# EAGLE design MJ818 clone - rev.5 - SN Mini2 - TCAN334 - prod (EAGLE 9.6.2)
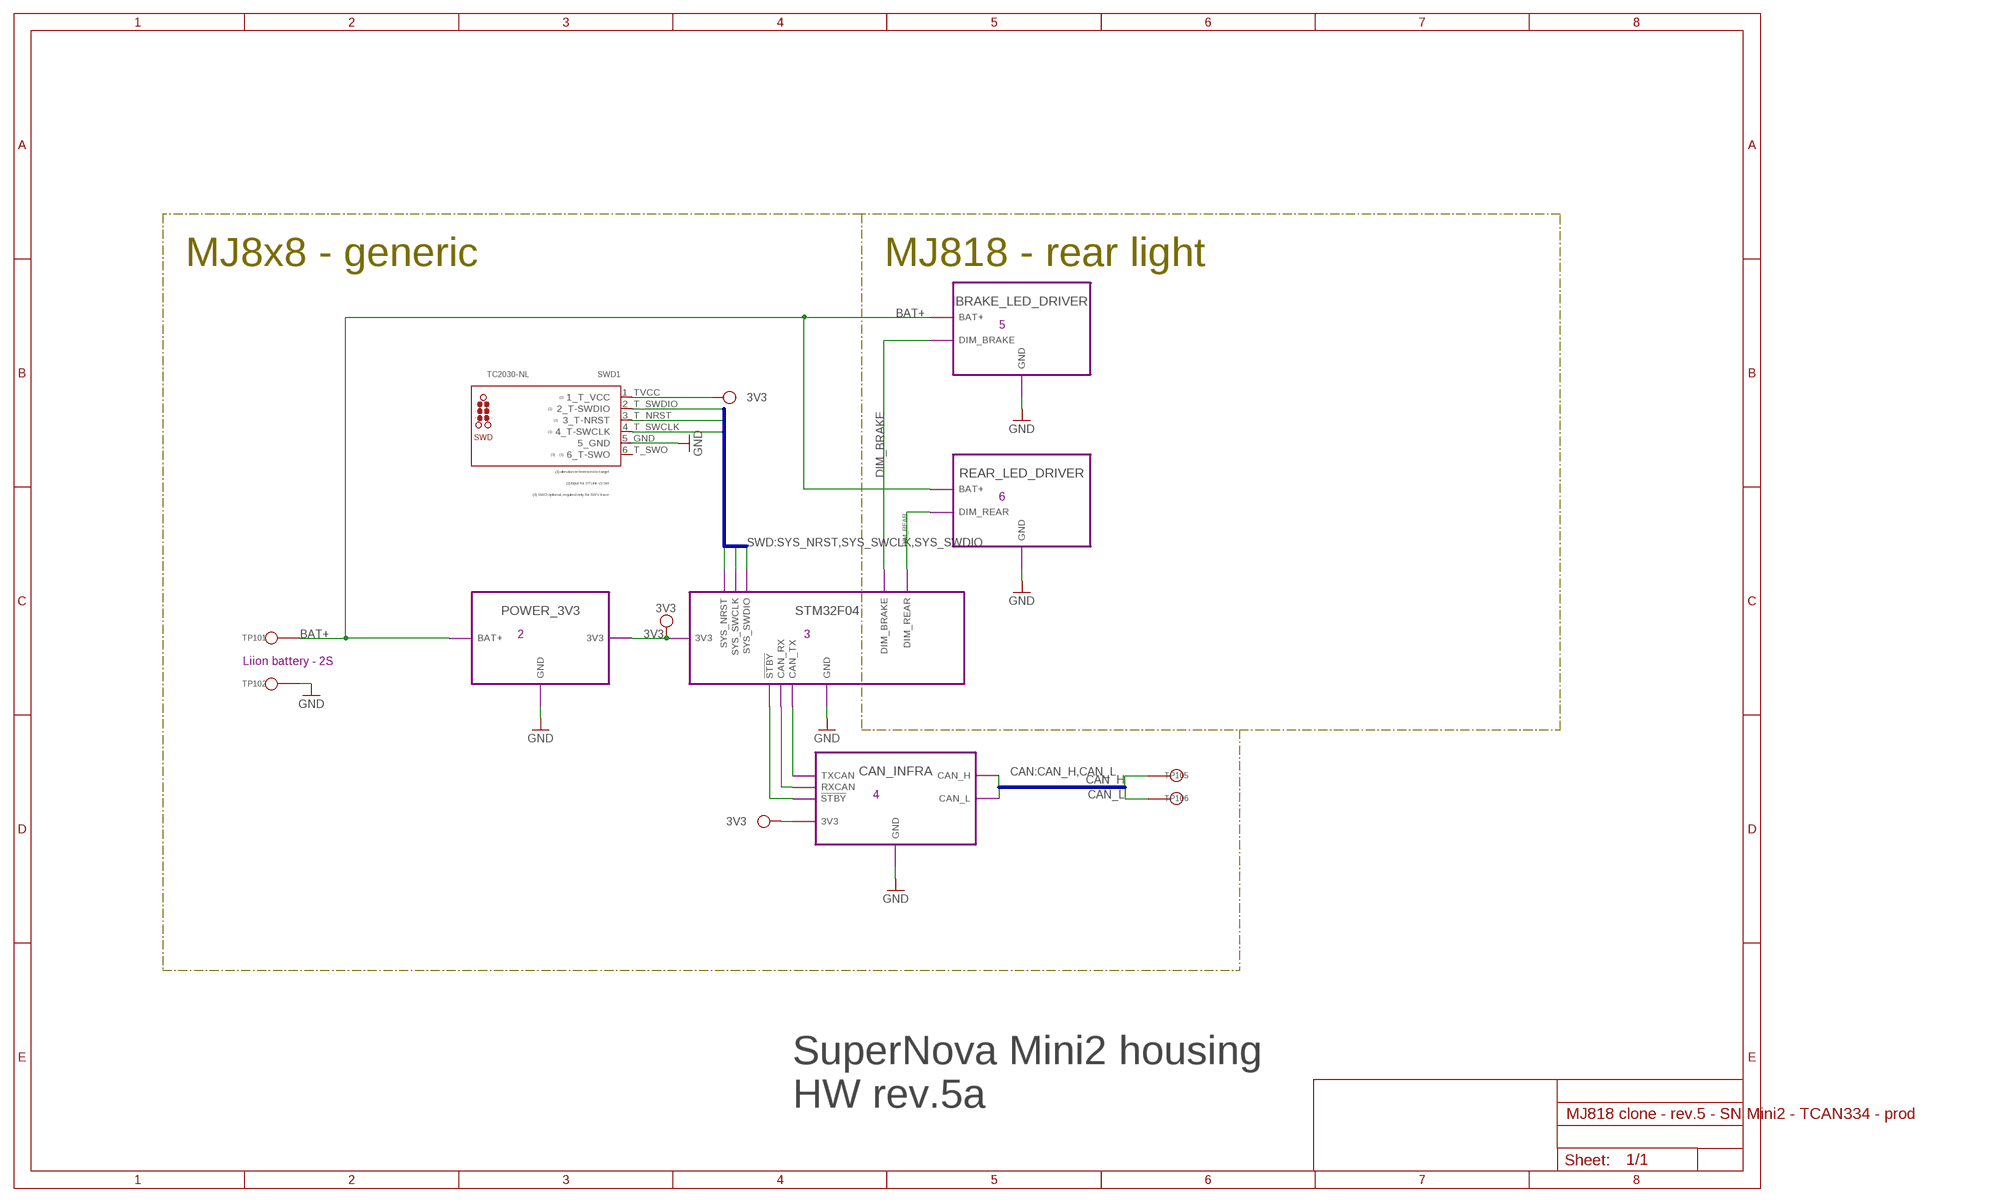
[diagram p0: schematic, sheet 1]

## Parts
SWD1  TC2030-NL  TC2030  [TC2030-NL]
TP101  LiIon + Terminal  TP  [TH-0.6]
TP102  LiIon - Terminal  TP  [TH-0.6]
TP105  CAN high  TP  [TH-0.6]
TP106  CAN low  TP  [TH-0.6]

## Module instances
POWER_3V3 = POWER_3V3 (part numbers offset by 200)
STM32F04 = STM32 (part numbers offset by 300)
CAN_INFRA = CAN_INFRA (part numbers offset by 400)
BRAKE_LED_DRIVER = LED_DRIVER_BRAKE-LIGHT (part numbers offset by 500)
REAR_LED_DRIVER = LED_DRIVER_REAR-LIGHT (part numbers offset by 600)

## Nets
3V3 [3V3]: SWD1.1_TVCC(1_T_VCC) ; port STM32F04.3V3 POWER_3V3.3V3 CAN_INFRA.3V3
!STBY! [signal]: port CAN_INFRA.!STBY! STM32F04.!STBY!
BAT+ [BAT+]: TP101.TP$1 ; port POWER_3V3.BAT+ BRAKE_LED_DRIVER.BAT+ REAR_LED_DRIVER.BAT+
CAN_H [signal]: TP105.TP$1 ; port CAN_INFRA.CAN_H
CAN_L [signal]: TP106.TP$1 ; port CAN_INFRA.CAN_L
CAN_RX [signal]: port CAN_INFRA.RXCAN STM32F04.CAN_RX
CAN_TX [signal]: port CAN_INFRA.TXCAN STM32F04.CAN_TX
DIM_BRAKE [signal]: port STM32F04.DIM_BRAKE BRAKE_LED_DRIVER.DIM_BRAKE
DIM_REAR [signal]: port STM32F04.DIM_REAR REAR_LED_DRIVER.DIM_REAR
GND: SWD1.5_GND TP102.TP$1 ; port STM32F04.GND POWER_3V3.GND CAN_INFRA.GND BRAKE_LED_DRIVER.GND REAR_LED_DRIVER.GND
SYS_NRST [signal]: SWD1.3_T_NRST(3_T-NRST) ; port STM32F04.SYS_NRST
SYS_SWCLK [signal]: SWD1.4_T_SWCLK(4_T-SWCLK) ; port STM32F04.SYS_SWCLK
SYS_SWDIO [signal]: SWD1.2_T_SWDIO(2_T-SWDIO) ; port STM32F04.SYS_SWDIO
Unconnected: SWD1.6_T_SWO(6_T-SWO)

## Buses
CAN:CAN_H,CAN_L
SWD:SYS_NRST,SYS_SWCLK,SYS_SWDIO

## Notes on the sheet
- MJ8x8 - generic | MJ818 - rear light
- 5
- 6
- 2 | 3
- Liion battery - 2S
- 4
- SuperNova Mini2 housing
  HW rev.5a

## Library data of the parts
SWD1 = tag-connect:TC2030: TC2030 pad no. Function STLink v3 CN1 pin no. Function 1 Reserved (1) 2 Reserved (1) 1 T_Vcc 3 T_Vcc (2) 2 T_SWDIO 4 T_JTMS/T_SWDIO 5 GND 4 T_SWCLK 6 T_JCLK / T_SWCLK 5 GND 7 GND 6 8 T_JTDO / T_SWO (3) 9 T_JRCLK (4) / NC (5) 10 T_JTDI / NC (5) 11 GNDDetect (6) 3 T_NRST 12 T_NRST 13 T_VCP_RX (7) 14 T_VCP_TX (2) (1) Do not connect to the target (2) Input for STLINK-V3SET (3) SWO is optional, required only for Serial Wire Viewer (SWV) trace (4) Optional loopback of T_JCLK on the target side, required if loopback is removed on the STLINK-V3SET side (5) NC means not required for the SWD connection (6) Tied to GND by STLINK-V3SET firmware; may be used by the target for detection of the tool (7) Output for STLINK-V3SET
TP101 TP102 TP105 TP106 = signal testpoint:TP

## Module POWER_3V3
Ports: GND(pwr) BAT+(pwr) 3V3(pwr)
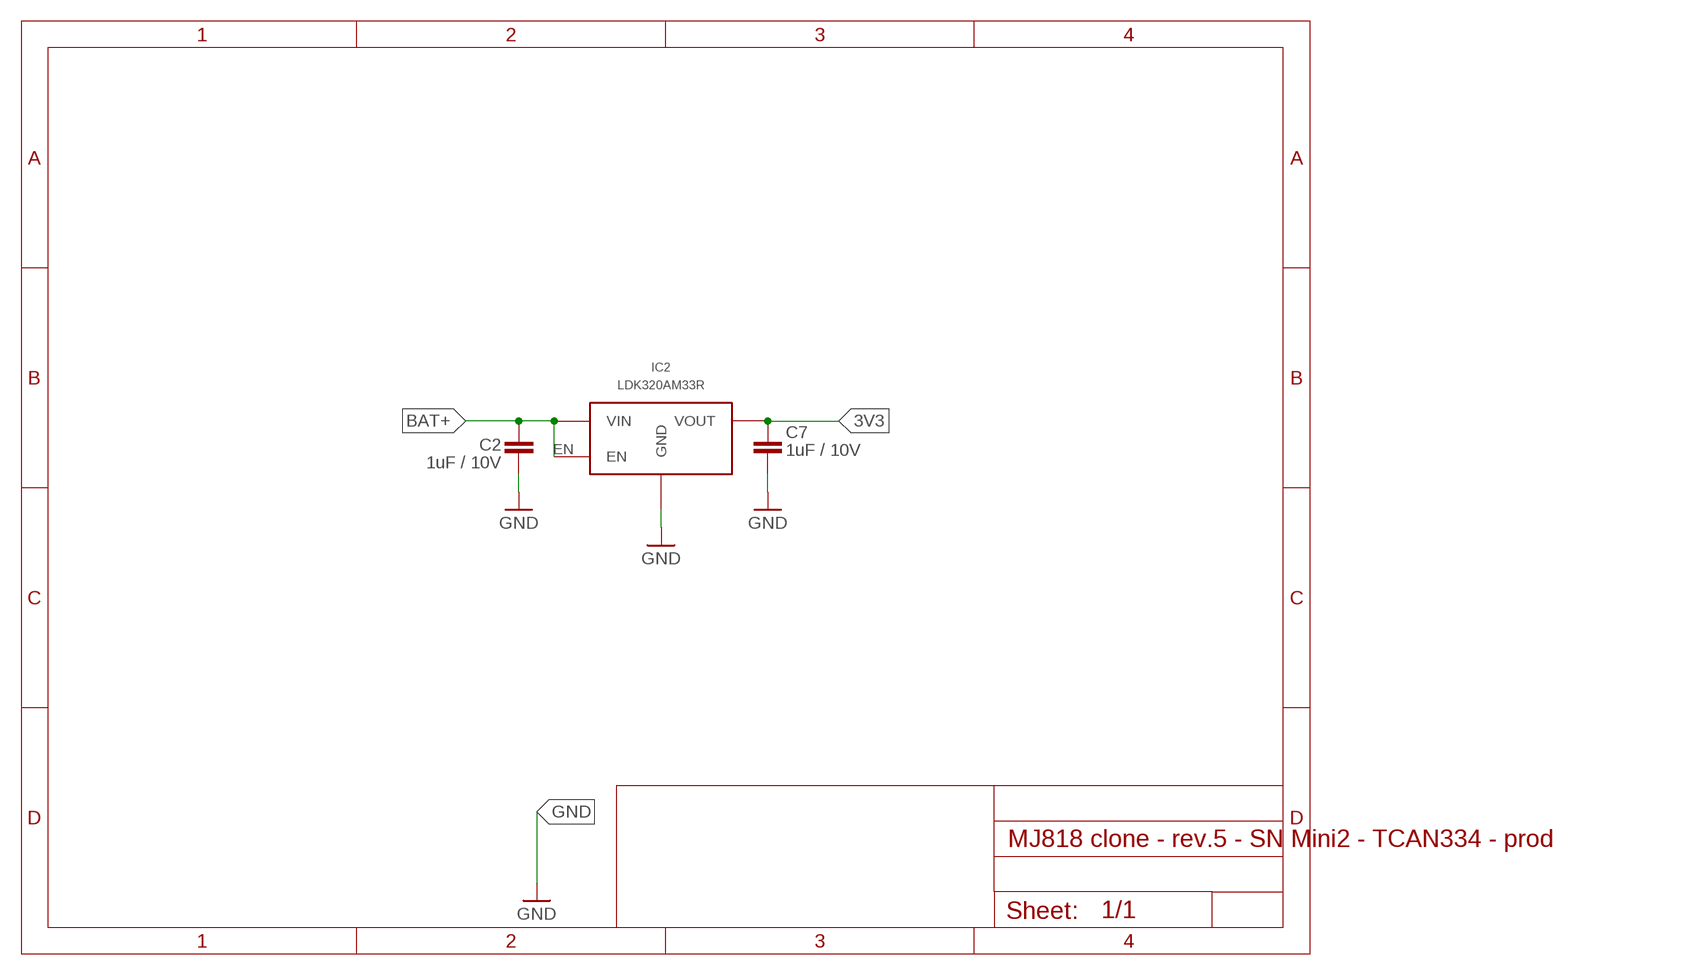
[diagram p1: schematic, module POWER_3V3, sheet 1]

### Parts
C2  1uF / 10V  C-EUC0402  [C0402]
C7  1uF / 10V  C-EUC0402  [C0402]
IC2  LDK320AM33R  LDK320SOT-23-5L  [SOT-23-5L]

### Nets
3V3: C7.2 IC2.OUT(VOUT)
BAT+ [BAT+]: C2.1 IC2.EN IC2.IN(VIN)
GND: C2.2 C7.1 IC2.GND

### Library data of the parts
C2 C7 = rcl:C-EU: CAPACITOR, European symbol; SPICEPREFIX: C
IC2 = LDK320 5V LDO:LDK320

## Module STM32
Ports: GND(pwr) 3V3(pwr) SYS_NRST(in) SYS_SWCLK(io) SYS_SWDIO(io) CAN_RX(in) CAN_TX(out) !STBY!(out) DIM_REAR(out) DIM_BRAKE(out)
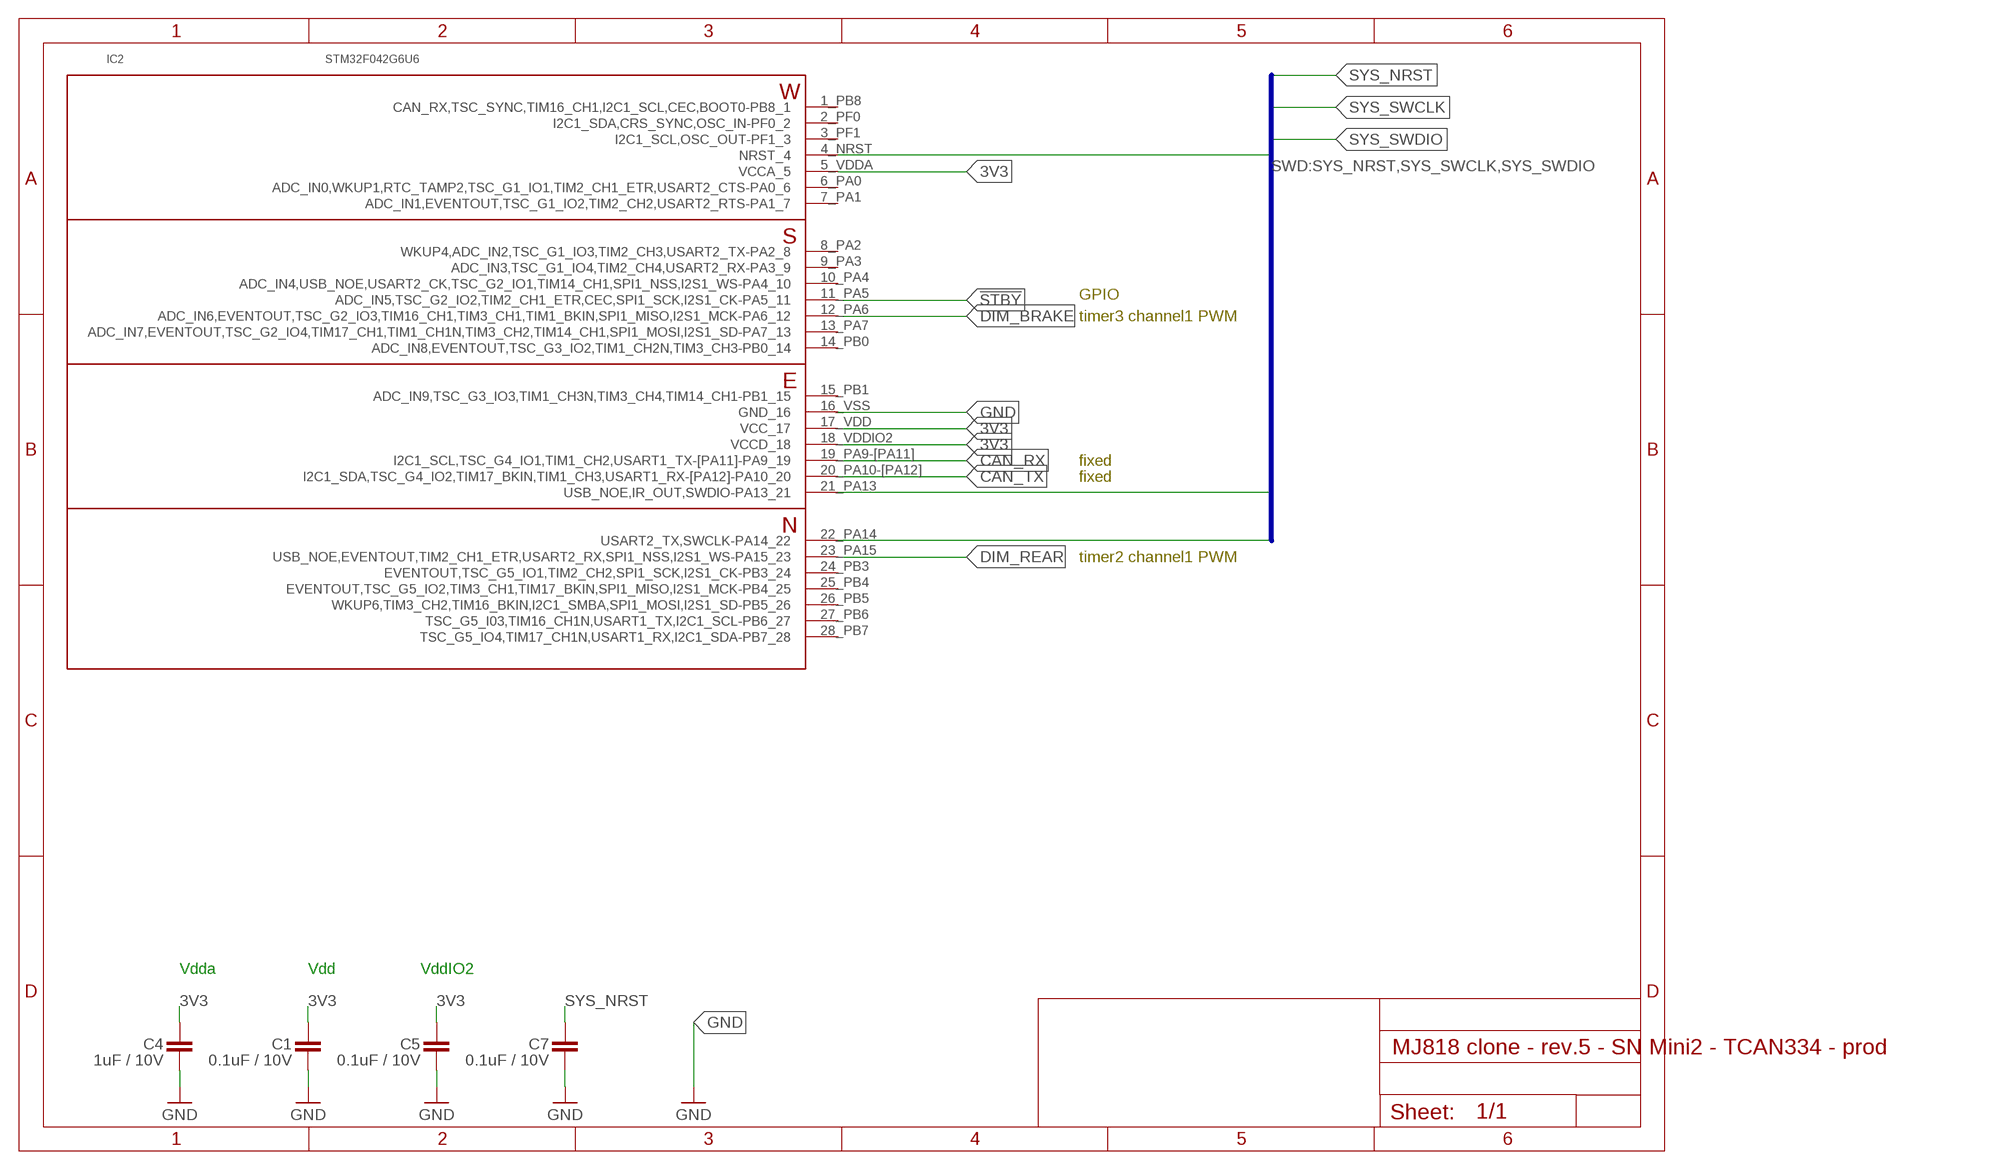
[diagram p2: schematic, module STM32, sheet 1]

### Parts
C1  0.1uF / 10V  C-EUC0402  [C0402]
C4  1uF / 10V  C-EUC0402  [C0402]
C5  0.1uF / 10V  C-EUC0402  [C0402]
C7  0.1uF / 10V  C-EUC0402  [C0402]
IC2  STM32F042G6U6  STM32F042G6  [UFQFPN-28]

### Nets
3V3 [3V3]: C1.2 C4.2 C5.2 IC2.5_VDDA(VCCA_5) IC2.17_VDD(VCC_17) IC2.18_VDDIO2(VCCD_18)
!STBY!: IC2.11_PA5(ADC_IN5,TSC_G2_IO2,TIM2_CH1_ETR,CEC,SPI1_SCK,I2S1_CK-PA5_11)
CAN_RX: IC2.19_PA9-[PA11](I2C1_SCL,TSC_G4_IO1,TIM1_CH2,USART1_TX-[PA11]-PA9_19)
CAN_TX: IC2.20_PA10-[PA12](I2C1_SDA,TSC_G4_IO2,TIM17_BKIN,TIM1_CH3,USART1_RX-[PA12]-PA10_20)
DIM_BRAKE: IC2.12_PA6(ADC_IN6,EVENTOUT,TSC_G2_IO3,TIM16_CH1,TIM3_CH1,TIM1_BKIN,SPI1_MISO,I2S1_MCK-PA6_12)
DIM_REAR: IC2.23_PA15(USB_NOE,EVENTOUT,TIM2_CH1_ETR,USART2_RX,SPI1_NSS,I2S1_WS-PA15_23)
GND: C1.1 C4.1 C5.1 C7.1 IC2.16_VSS(GND_16)
SYS_NRST: C7.2 IC2.4_NRST(NRST_4)
SYS_SWCLK: IC2.22_PA14(USART2_TX,SWCLK-PA14_22)
SYS_SWDIO: IC2.21_PA13(USB_NOE,IR_OUT,SWDIO-PA13_21)
Unconnected: IC2.1_PB8(CAN_RX,TSC_SYNC,TIM16_CH1,I2C1_SCL,CEC,BOOT0-PB8_1) IC2.2_PF0(I2C1_SDA,CRS_SYNC,OSC_IN-PF0_2) IC2.3_PF1(I2C1_SCL,OSC_OUT-PF1_3) IC2.6_PA0(ADC_IN0,WKUP1,RTC_TAMP2,TSC_G1_IO1,TIM2_CH1_ETR,USART2_CTS-PA0_6) IC2.7_PA1(ADC_IN1,EVENTOUT,TSC_G1_IO2,TIM2_CH2,USART2_RTS-PA1_7) IC2.8_PA2(WKUP4,ADC_IN2,TSC_G1_IO3,TIM2_CH3,USART2_TX-PA2_8) IC2.9_PA3(ADC_IN3,TSC_G1_IO4,TIM2_CH4,USART2_RX-PA3_9) IC2.10_PA4(ADC_IN4,USB_NOE,USART2_CK,TSC_G2_IO1,TIM14_CH1,SPI1_NSS,I2S1_WS-PA4_10) IC2.13_PA7(ADC_IN7,EVENTOUT,TSC_G2_IO4,TIM17_CH1,TIM1_CH1N,TIM3_CH2,TIM14_CH1,SPI1_MOSI,I2S1_SD-PA7_13) IC2.14_PB0(ADC_IN8,EVENTOUT,TSC_G3_IO2,TIM1_CH2N,TIM3_CH3-PB0_14) IC2.15_PB1(ADC_IN9,TSC_G3_IO3,TIM1_CH3N,TIM3_CH4,TIM14_CH1-PB1_15) IC2.24_PB3(EVENTOUT,TSC_G5_IO1,TIM2_CH2,SPI1_SCK,I2S1_CK-PB3_24) IC2.25_PB4(EVENTOUT,TSC_G5_IO2,TIM3_CH1,TIM17_BKIN,SPI1_MISO,I2S1_MCK-PB4_25) IC2.26_PB5(WKUP6,TIM3_CH2,TIM16_BKIN,I2C1_SMBA,SPI1_MOSI,I2S1_SD-PB5_26) IC2.27_PB6(TSC_G5_I03,TIM16_CH1N,USART1_TX,I2C1_SCL-PB6_27) IC2.28_PB7(TSC_G5_IO4,TIM17_CH1N,USART1_RX,I2C1_SDA-PB7_28)

### Buses
SWD:SYS_NRST,SYS_SWCLK,SYS_SWDIO

### Notes on the sheet
- GPIO
- timer3 channel1 PWM
- fixed
- fixed
- timer2 channel1 PWM
- Vdda | Vdd | VddIO2

### Library data of the parts
C1 C4 C5 C7 = rcl:C-EU: CAPACITOR, European symbol; SPICEPREFIX: C
IC2 = STM32F042G6:STM32F042G6

## Module CAN_INFRA
Ports: GND(pwr) 3V3(pwr) CAN_H(io) CAN_L(io) TXCAN(in) RXCAN(out) !STBY!(in)
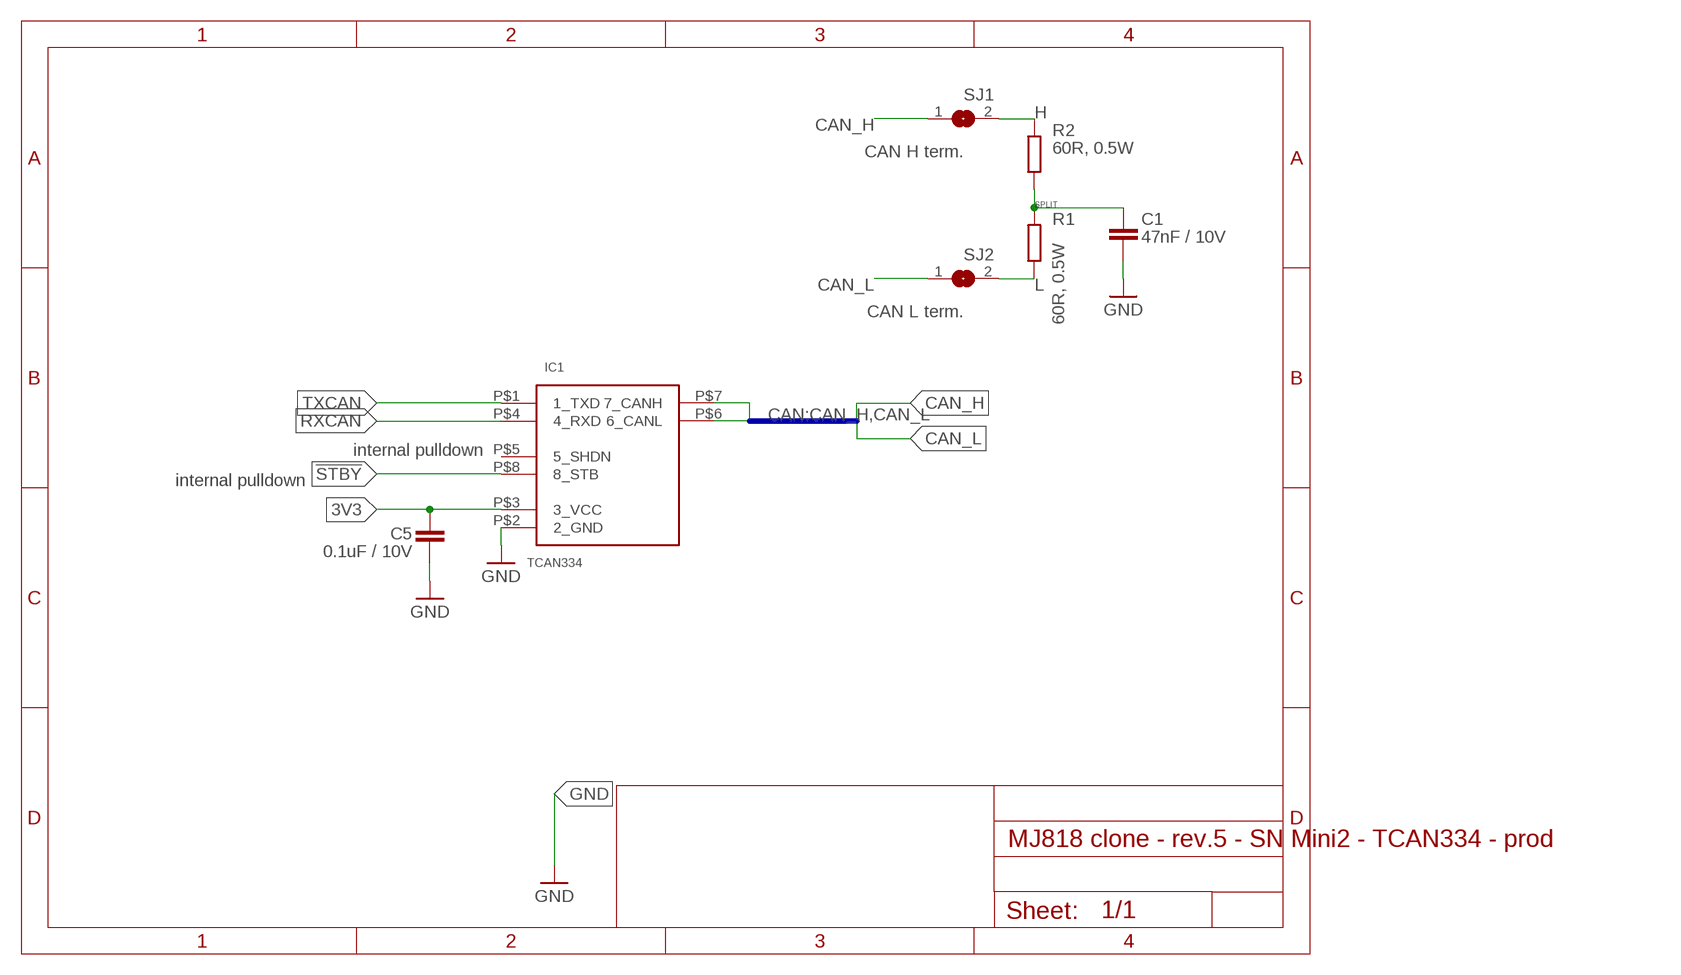
[diagram p3: schematic, module CAN_INFRA, sheet 1]

### Parts
C1  47nF / 10V  C-EUC0402  [C0402]
C5  0.1uF / 10V  C-EUC0402  [C0402]
IC1  TCAN334  CAN33X  [SOT23-8]
R1  60R, 0.5W  R-EU_R0805  [R0805]
R2  60R, 0.5W  R-EU_R0805  [R0805]
SJ1  CAN H term.  SJ  [SJ]
SJ2  CAN L term.  SJ  [SJ]

### Nets
3V3 [3V3]: C5.1 IC1.P$3(3_VCC)
!STBY! [signal]: IC1.P$8(8_STB)
CAN_H: IC1.P$7(7_CANH) SJ1.1
CAN_L: IC1.P$6(6_CANL) SJ2.1
GND: C1.2 C5.2 IC1.P$2(2_GND)
H: R2.2 SJ1.2
L: R1.1 SJ2.2
RXCAN [signal]: IC1.P$4(4_RXD)
SPLIT [signal]: C1.1 R1.2 R2.1
TXCAN [signal]: IC1.P$1(1_TXD)
Unconnected: IC1.P$5(5_SHDN)

### Buses
CAN:CAN_H,CAN_L

### Notes on the sheet
- internal pulldown
- internal pulldown

### Library data of the parts
C1 C5 = rcl:C-EU: CAPACITOR, European symbol; SPICEPREFIX: C
IC1 = TCAN33x - 3.3V CAN Transciever:CAN33X
R1 R2 = rcl:R-EU_: RESISTOR, European symbol; SPICEPREFIX: R
SJ1 SJ2 = jumper:SJ: SMD solder JUMPER

## Module LED_DRIVER_BRAKE-LIGHT
Ports: GND(pwr) DIM_BRAKE(in) BAT+(pwr)
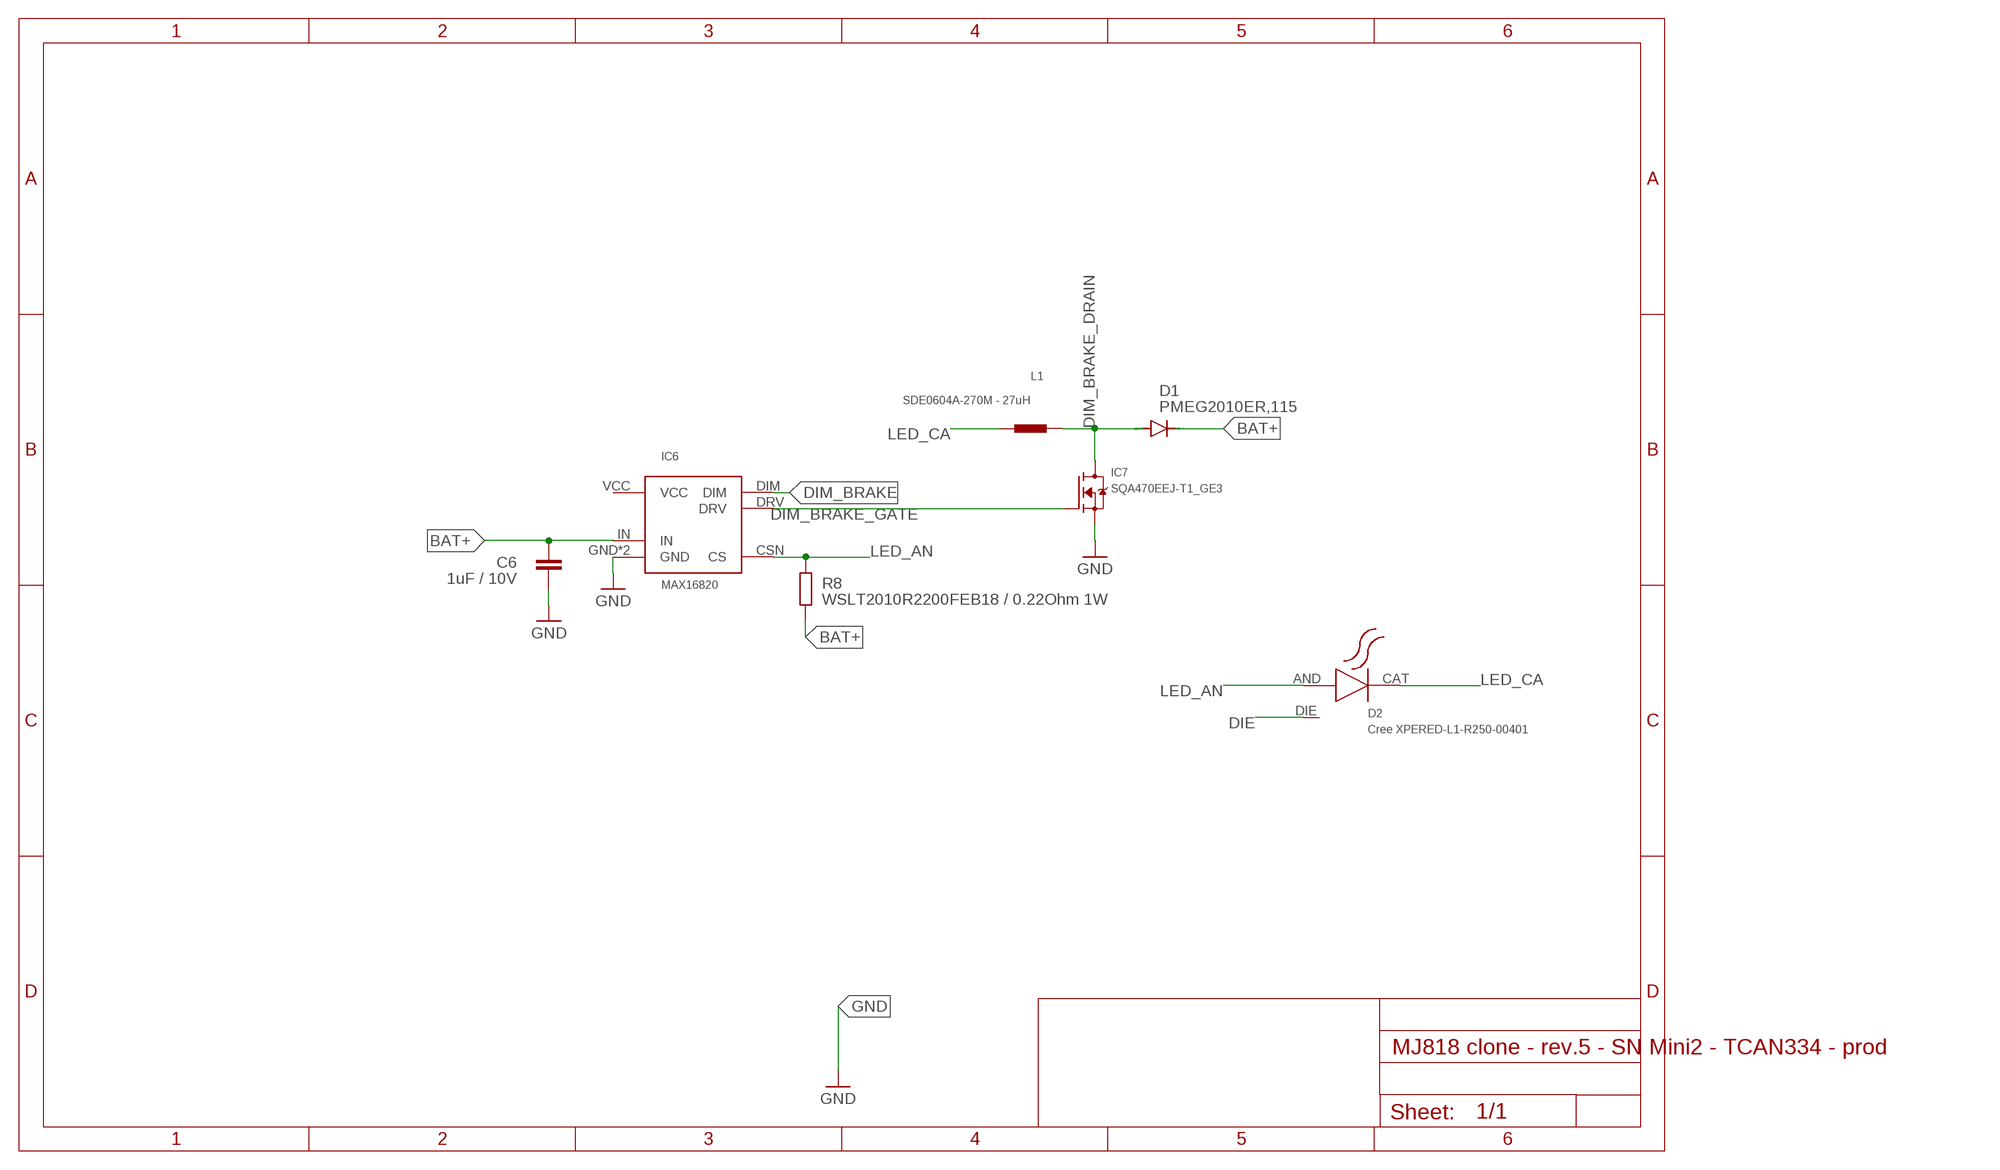
[diagram p4: schematic, module LED_DRIVER_BRAKE-LIGHT, sheet 1]

### Parts
C6  1uF / 10V  C-EUC0402  [C0402]
D1  PMEG2010ER,115  DIODE-SOD123  [SOD123]
D2  Cree XPERED-L1-R250-00401  XLAMPXPE-221789  [SMD]
IC6  MAX16820  [TDFN-6-EP]
IC7  SQA470EEJ-T1_GE3  SIA456DJ  [SC-70-6]
L1  SDE0604A-270M - 27uH  DE0604A-778075  [SMT]
R8  WSLT2010R2200FEB18 / 0.22Ohm 1W  R-EU_R2010  [R2010]

### Nets
BAT+ [BAT+]: C6.1 D1.C IC6.IN R8.2
DIE: D2.DIE
DIM_BRAKE [signal]: IC6.DIM
DIM_BRAKE_DRAIN [signal]: D1.A IC7.1D(D) IC7.2D(D) IC7.5D(D) IC7.6D(D) IC7.D L1.P$2
DIM_BRAKE_GATE [signal]: IC6.DRV IC7.3G(G)
GND: C6.2 IC6.GND IC6.GND1(GND) IC7.4S(S) IC7.S
LED_AN [BAT+]: D2.AND IC6.CSN(CS) R8.1
LED_CA [BAT+]: D2.CAT L1.P$1

### Power pins joined to a net without a drawn wire
VCC: IC6.VCC

### Library data of the parts
C6 = rcl:C-EU: CAPACITOR, European symbol; SPICEPREFIX: C
D1 = diode:DIODE-: DIODE
D2 = XLampXPE-221789:XLAMPXPE-221789
IC6 = MAX16820 LED Driver, constant current:MAX16820
IC7 = SIA456DJ-T1-GE3  N-Fet:SIA456DJ
L1 = DE0604A-778075 - Inductor:DE0604A-778075
R8 = rcl:R-EU_: RESISTOR, European symbol; SPICEPREFIX: R

## Module LED_DRIVER_REAR-LIGHT
Ports: GND(pwr) BAT+(pwr) DIM_REAR(in)
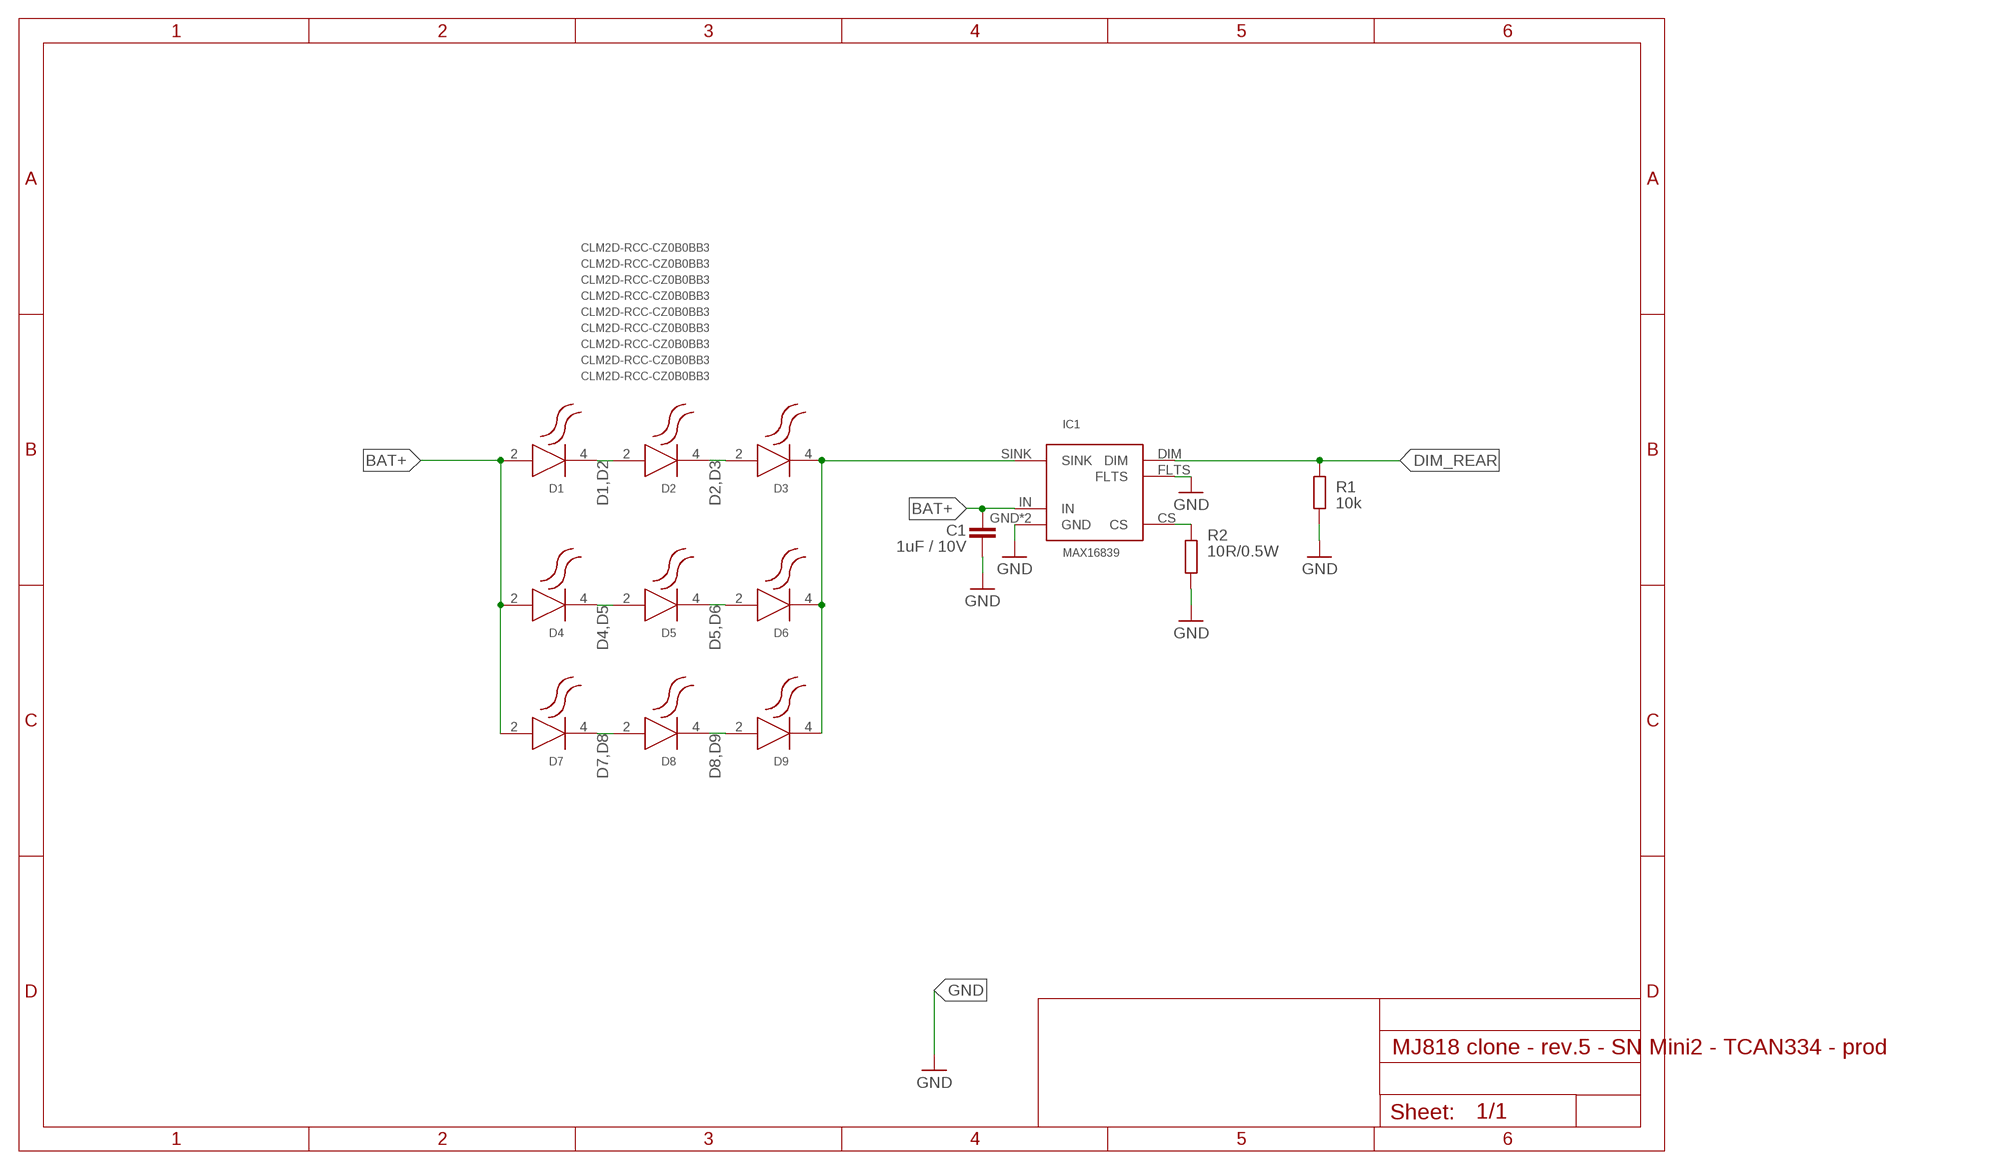
[diagram p5: schematic, module LED_DRIVER_REAR-LIGHT, sheet 1]

### Parts
C1  1uF / 10V  C-EUC0402  [C0402]
D1  CLM2D-RCC-CZ0B0BB3  1374-CLM2D-RCC-ACC-1064252  [SMD]
D2  CLM2D-RCC-CZ0B0BB3  1374-CLM2D-RCC-ACC-1064252  [SMD]
D3  CLM2D-RCC-CZ0B0BB3  1374-CLM2D-RCC-ACC-1064252  [SMD]
D4  CLM2D-RCC-CZ0B0BB3  1374-CLM2D-RCC-ACC-1064252  [SMD]
D5  CLM2D-RCC-CZ0B0BB3  1374-CLM2D-RCC-ACC-1064252  [SMD]
D6  CLM2D-RCC-CZ0B0BB3  1374-CLM2D-RCC-ACC-1064252  [SMD]
D7  CLM2D-RCC-CZ0B0BB3  1374-CLM2D-RCC-ACC-1064252  [SMD]
D8  CLM2D-RCC-CZ0B0BB3  1374-CLM2D-RCC-ACC-1064252  [SMD]
D9  CLM2D-RCC-CZ0B0BB3  1374-CLM2D-RCC-ACC-1064252  [SMD]
IC1  MAX16839  MAX16839  [TDFN-6-EP]
R1  10k  R-EU_R0402  [R0402]
R2  10R/0.5W  R-EU_R1206  [R1206]

### Nets
BAT+ [BAT+]: C1.2 D1.2(A) D4.2(A) D7.2(A) IC1.IN
CS [BAT+]: IC1.CS R2.1
D1,D2 [BAT+]: D1.4(C) D2.2(A)
D2,D3 [BAT+]: D2.4(C) D3.2(A)
D4,D5 [BAT+]: D4.4(C) D5.2(A)
D5,D6 [BAT+]: D5.4(C) D6.2(A)
D7,D8 [BAT+]: D7.4(C) D8.2(A)
D8,D9 [BAT+]: D8.4(C) D9.2(A)
DIM_REAR [signal]: IC1.DIM R1.2
GND: C1.1 IC1.FLTS IC1.GND IC1.GND1(GND) R1.1 R2.2
SINK [BAT+]: D3.4(C) D6.4(C) D9.4(C) IC1.SINK

### Library data of the parts
C1 = rcl:C-EU: CAPACITOR, European symbol; SPICEPREFIX: C
D1-D9 = 1374-CLM2D-RCC-ACC-1064252 - Red SMD LED:1374-CLM2D-RCC-ACC-1064252
IC1 = MAX16839 LED Driver, constant current:MAX16839
R1 R2 = rcl:R-EU_: RESISTOR, European symbol; SPICEPREFIX: R

## Net classes
0 GND: width 0.25 mm, drill 0.35 mm, clearance 0.19 mm
1 BAT+: width 0.5 mm, drill 0.35 mm, clearance 0.19 mm
3 signal: width 0.25 mm, drill 0.35 mm, clearance 0.19 mm
4 3V3: width 0.25 mm, drill 0.35 mm, clearance 0.19 mm

## Board
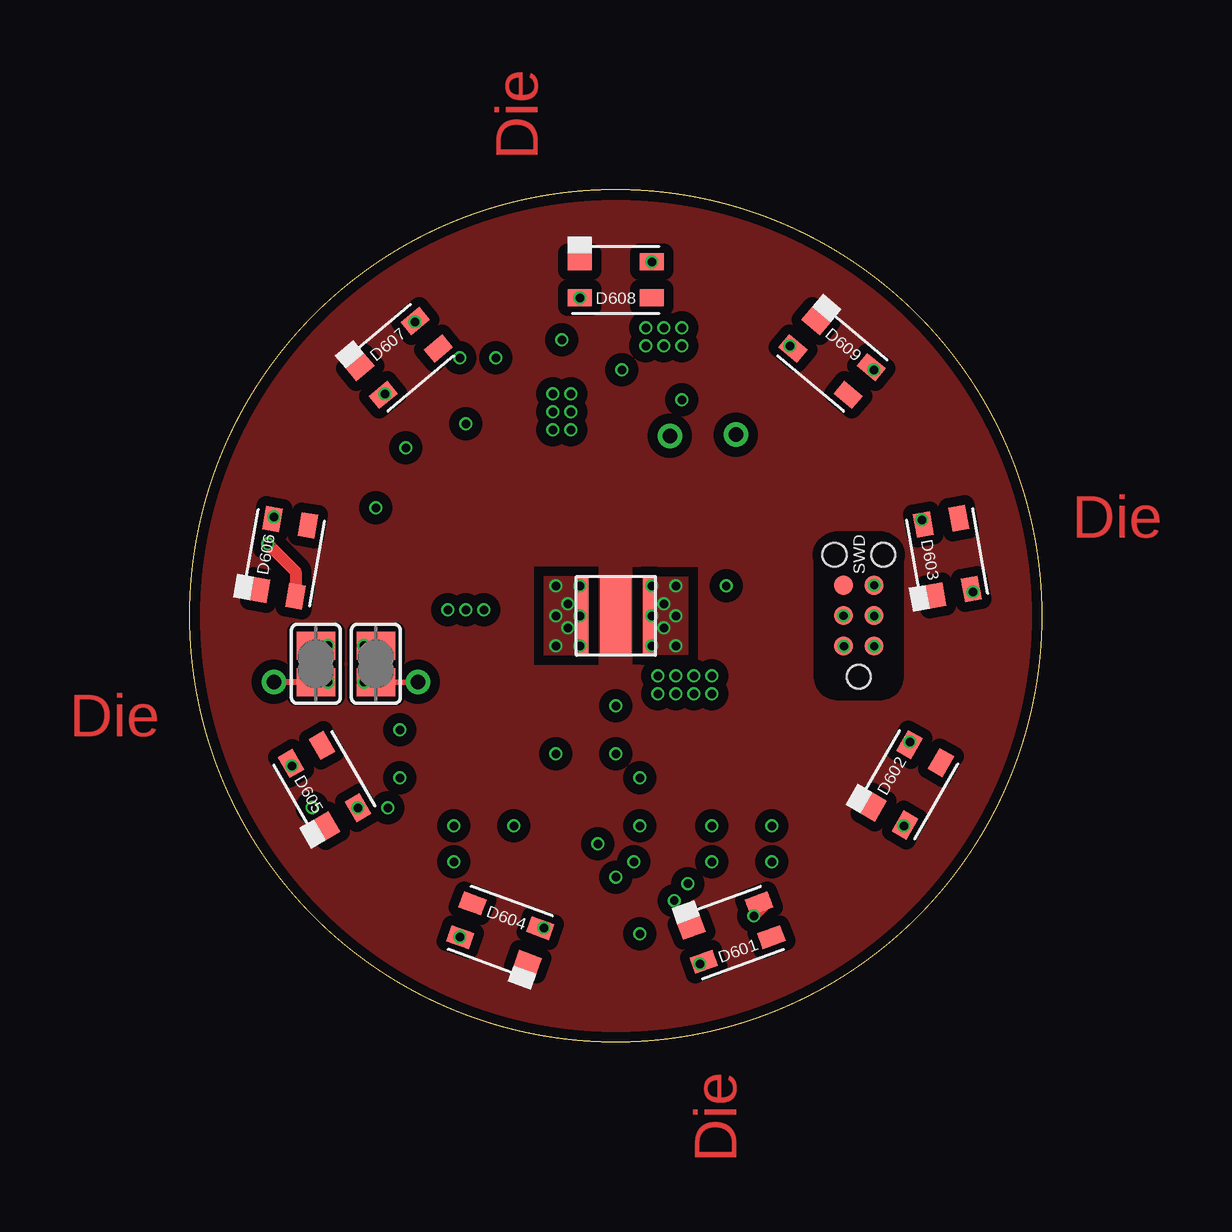
[diagram p6: board, top side]
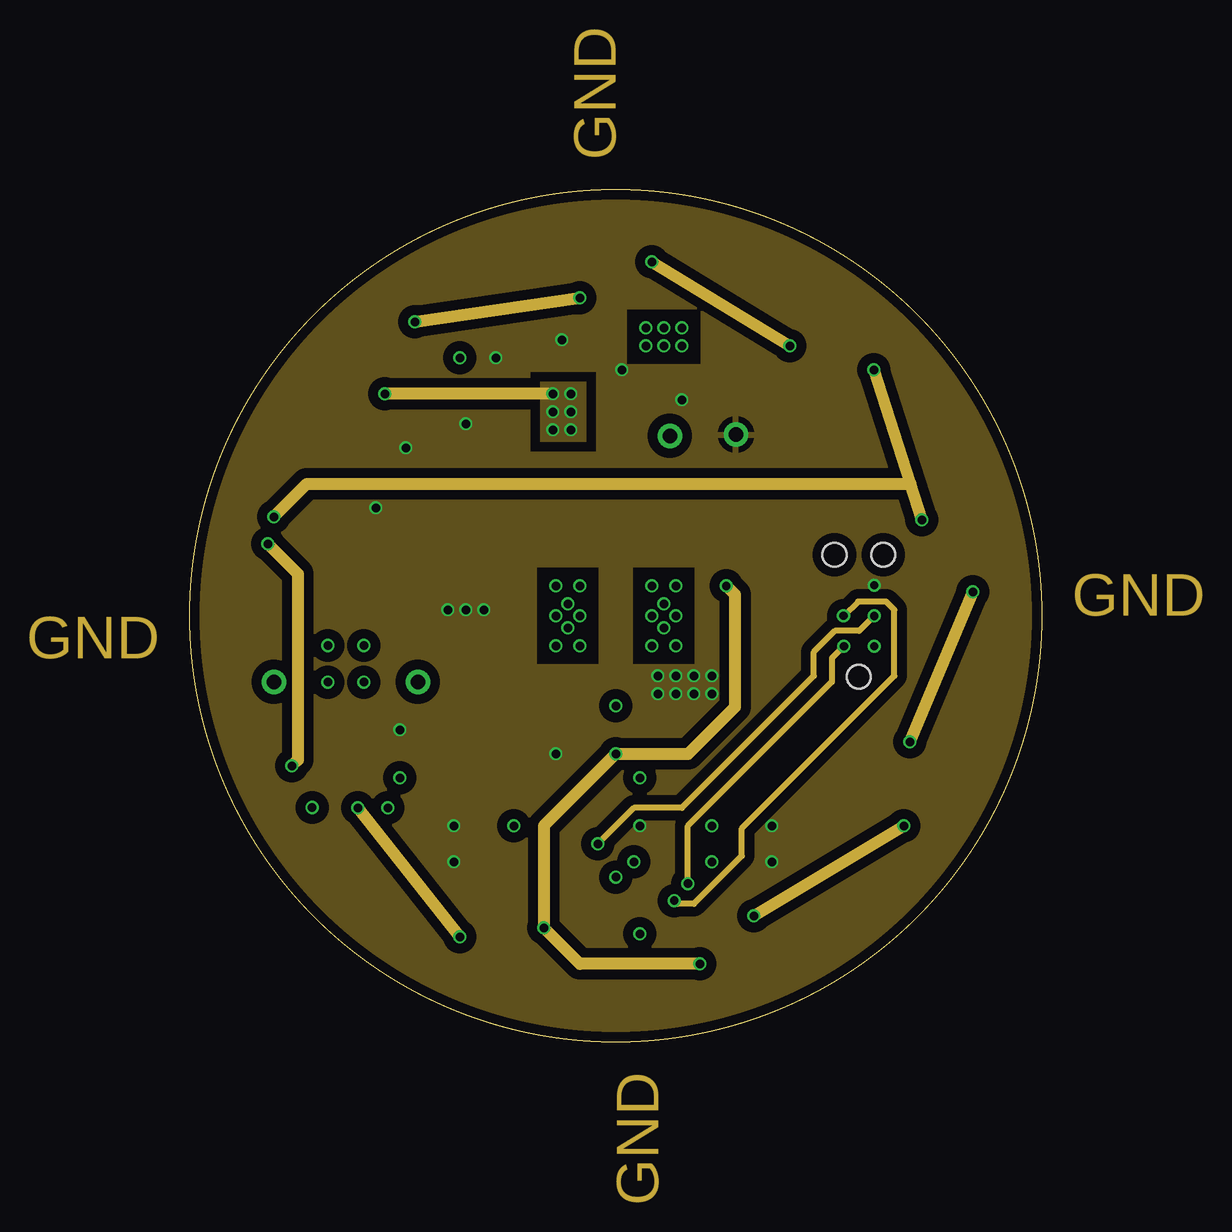
[diagram p7: board, inner layer Route2]
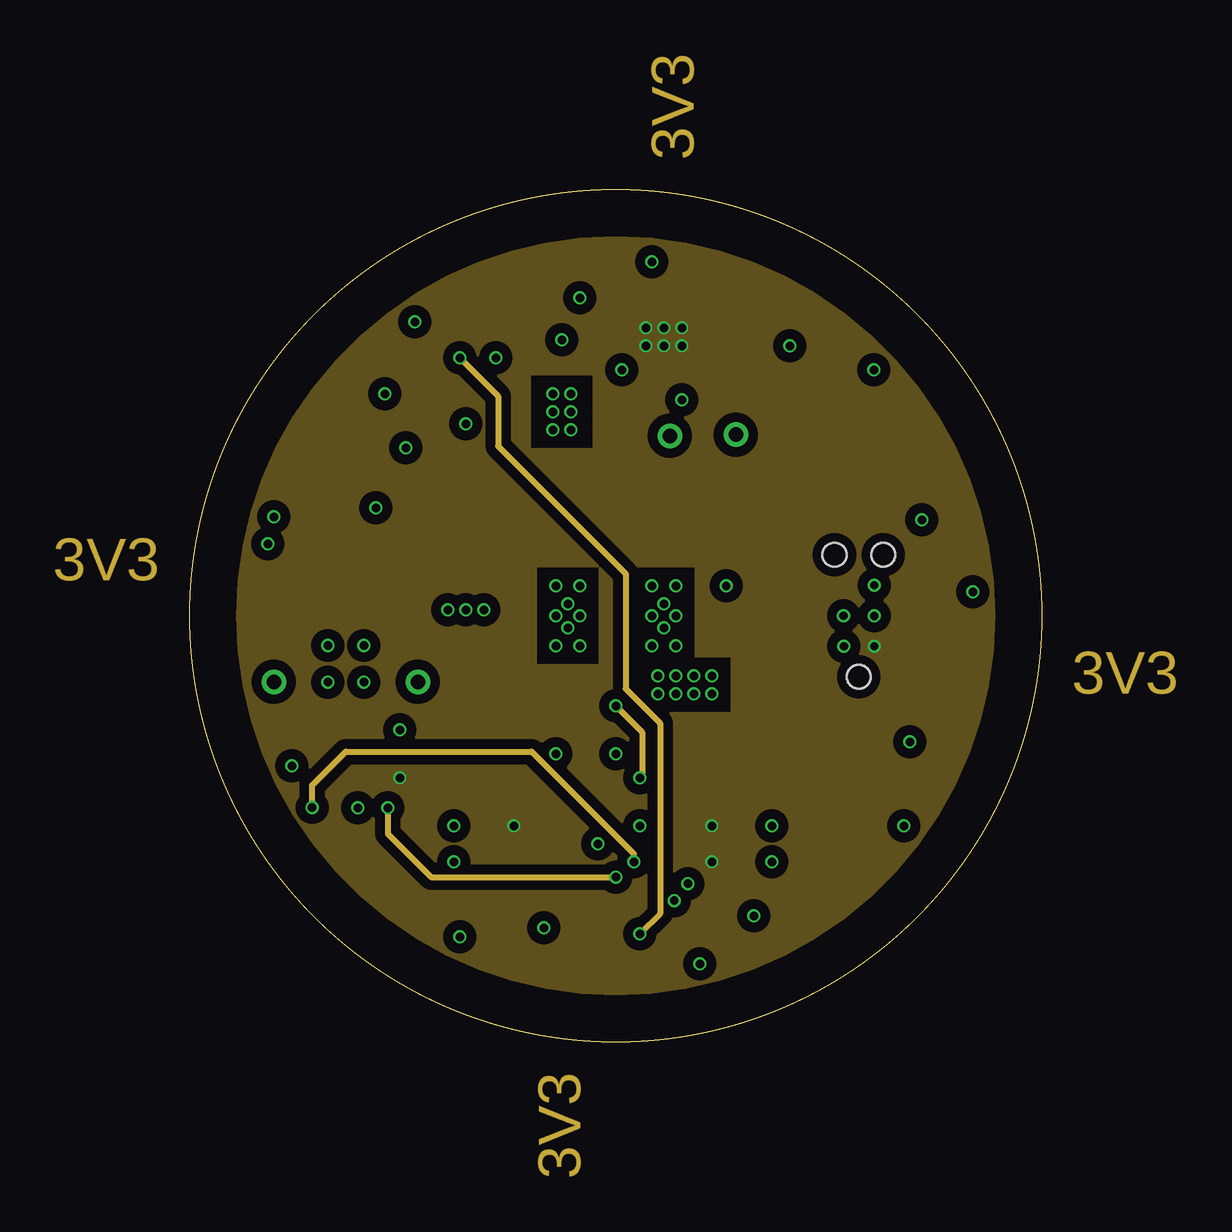
[diagram p8: board, inner layer Route15]
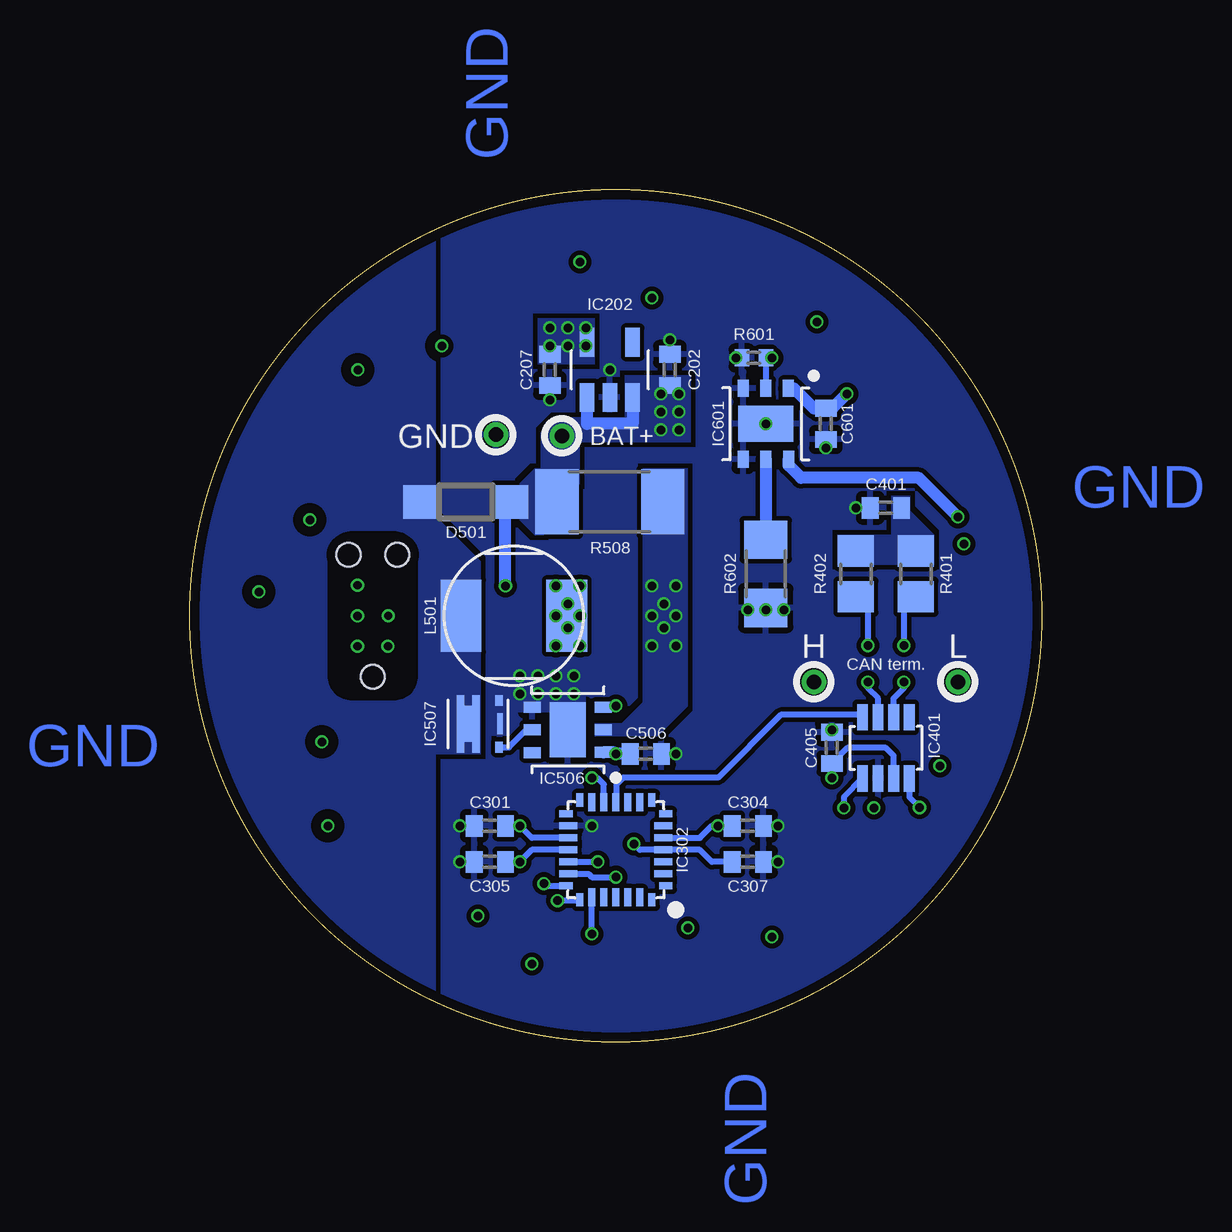
[diagram p9: board, bottom side, seen from below]

Size 35.5 x 35.5 mm. Coordinates in mm from the lower left corner, seen from the top.
Outline: circle at 17.75,17.75 radius 17.75
Copper layers (1*2*15*16): Top 0.035559375mm / dielectric 0.17018125mm / Route2 0.01778125mm / dielectric 47mil / Route15 0.01778125mm / dielectric 0.17018125mm / Bottom 0.035559375mm
Design rules "oshpark-4layer": minimum track width 5mil, minimum drill 10mil, track to track 5mil, track to pad 5mil, pad to pad 5mil, via to via 5mil, smd to smd 5mil, copper to edge 15mil, drill to drill 6mil, minimum pad ring 4mil, minimum via ring 4mil, stop-mask expansion 1.5mil, vias tented up to drill 0mil, thermal gap 10mil
bRestrict: 4 lines

### Footprints (pad centres in the part's own frame; a part is rotated, then mirrored left to right if it is on the bottom)
C0402 = smd 0.7 x 0.9: 1 -0.65,0; 2 0.65,0
SOD123 = smd 1.4 x 1.4: A 1.9,0; C -1.9,0
SMD = smd 0.5 x 3.3: AND -1.4,0; CAT 1.4,0 | smd 1.3 x 3.3: DIE 0,0
SMD' = smd 1 x 0.7: 1 -1.5,0.75; 2 -1.5,-0.75; 3 1.5,-0.75; 4 1.5,0.75
SOT-23-5L = smd 0.6 x 1.2: ADJ/NC -0.95,-1.15; EN -0.95,1.15; GND 0,1.15; IN 0.95,1.15; OUT 0.95,-1.15
UFQFPN-28 = smd 0.55 x 0.3: 1_PB8 -2.08,1.5; 7_PA1 -2.08,-1.5; 15_PB1 2.08,-1.5; 21_PA13 2.08,1.5 | smd 0.75 x 0.3: 2_PF0 -1.98,1; 3_PF1 -1.98,0.5; 4_NRST -1.98,0; 5_VDDA -1.98,-0.5; 6_PA0 -1.98,-1; 16_VSS 1.98,-1; 17_VDD 1.98,-0.5; 18_VDDIO2 1.98,0; 19_PA9-[PA11] 1.98,0.5; 20_PA10-[PA12] 1.98,1 | smd 0.3 x 0.55: 8_PA2 -1.5,-2.08; 14_PB0 1.5,-2.08; 22_PA14 1.5,2.08; 28_PB7 -1.5,2.08 | smd 0.3 x 0.75: 9_PA3 -1,-1.98; 10_PA4 -0.5,-1.98; 11_PA5 0,-1.98; 12_PA6 0.5,-1.98; 13_PA7 1,-1.98; 23_PA15 1,1.98; 24_PB3 0.5,1.98; 25_PB4 0,1.98; 26_PB5 -0.5,1.98; 27_PB6 -1,1.98
SOT23-8 = smd 0.45 x 1.1: P$1 -0.975,-1.275; P$2 -0.325,-1.275; P$3 0.325,-1.275; P$4 0.975,-1.275; P$5 0.975,1.275; P$6 0.325,1.275; P$7 -0.325,1.275; P$8 -0.975,1.275
TDFN-6-EP = smd 0.71 x 0.46: CSN -1.48,0; DIM -1.48,-0.94; DRV 1.48,0; GND1 1.48,-0.95; IN -1.48,0.94; VCC 1.48,0.95 | smd 1.5 x 2.3: GND 0,0
SC-70-6 = smd 0.45 x 0.3: 1D -0.975,0.725; 2D -0.975,0.075; 3G -0.975,-0.88; 4S 0.975,-0.88; 5D 0.975,0.075; 6D 0.975,0.725 | smd 1.5 x 0.95: D 0,0.4 | smd 0.87 x 0.23: S 0,-0.915
TDFN-6-EP' = smd 0.71 x 0.46: CS 1.48,0; DIM -1.48,0; FLTS -1.48,-0.94; GND1 1.48,-0.95; IN -1.48,0.94; SINK 1.48,0.95 | smd 1.5 x 2.3: GND 0,0
SMT = smd 1.7 x 3: P$1 2.2,0; P$2 -2.2,0
R0805 = smd 1.3 x 1.5: 1 -0.95,0; 2 0.95,0
R2010 = smd 1.8 x 2.7: 1 -2.2,0; 2 2.2,0
R0402 = smd 0.6 x 0.7: 1 -0.5,0; 2 0.5,0
R1206 = smd 1.6 x 1.803: 1 -1.422,0; 2 1.422,0
SJ = smd 1.168 x 1.6: 1 -0.762,0; 2 0.762,0
TC2030-NL = smd 0.787 x 0.787: 1_TVCC 1.27,-0.635; 2_T_SWDIO 1.27,0.635; 3_T_NRST 2.54,-0.635; 4_T_SWCLK 2.54,0.635; 5_GND 3.81,-0.635; 6_T_SWO 3.81,0.635 | hole 0.991: 0,0; 5.08,-1.016; 5.08,1.016
TH-0.6 = drill 0.6 pad 1.016: TP$1 0,0

### Placement (x,y rotation side)
C202  1uF / 10V  [C0402]  15.5,28 90 bottom
C207  1uF / 10V  [C0402]  20.5,28 90 bottom
C301  0.1uF / 10V  [C0402]  23,9 0 bottom
C304  1uF / 10V  [C0402]  12.25,9 180 bottom
C305  0.1uF / 10V  [C0402]  23,7.5 0 bottom
C307  0.1uF / 10V  [C0402]  12.25,7.5 180 bottom
C401  47nF / 10V  [C0402]  6.5,22.25 180 bottom
C405  0.1uF / 10V  [C0402]  8.75,12.25 90 bottom
C506  1uF / 10V  [C0402]  16.5,12 0 bottom
C601  1uF / 10V  [C0402]  9,25.75 90 bottom
D501  PMEG2010ER,115  [SOD123]  24,22.5 180 bottom
D502  Cree XPERED-L1-R250-00401  [SMD]  17.75,17.75 0 top
D601  CLM2D-RCC-CZ0B0BB3  [SMD']  22.57,4.55 20 top
D602  CLM2D-RCC-CZ0B0BB3  [SMD']  29.89,10.71 60 top
D603  CLM2D-RCC-CZ0B0BB3  [SMD']  31.56,20.21 100 top
D604  CLM2D-RCC-CZ0B0BB3  [SMD']  12.93,4.55 160 top
D605  CLM2D-RCC-CZ0B0BB3  [SMD']  5.61,10.68 120 top
D606  CLM2D-RCC-CZ0B0BB3  [SMD']  3.93,20.18 80 top
D607  CLM2D-RCC-CZ0B0BB3  [SMD']  8.72,28.5 40 top
D608  CLM2D-RCC-CZ0B0BB3  [SMD']  17.75,31.75 0 top
D609  CLM2D-RCC-CZ0B0BB3  [SMD']  26.76,28.5 320 top
IC202  LDK320AM33R  [SOT-23-5L]  18,28 180 bottom
IC302  STM32F042G6U6  [UFQFPN-28]  17.75,8 180 bottom
IC401  TCAN334  [SOT23-8]  6.5,12.25 0 bottom
IC506  MAX16820  [TDFN-6-EP]  19.75,13 180 bottom
IC507  SQA470EEJ-T1_GE3  [SC-70-6]  23.5,13.25 90 bottom
IC601  MAX16839  [TDFN-6-EP']  11.5,25.75 270 bottom
L501  SDE0604A-270M - 27uH  [SMT]  22,17.75 0 bottom
R401  60R, 0.5W  [R0805]  5.25,19.5 90 bottom
R402  60R, 0.5W  [R0805]  7.75,19.5 270 bottom
R508  WSLT2010R2200FEB18 / 0.22Ohm 1W  [R2010]  18,22.5 180 bottom
R601  10k  [R0402]  12,28.5 0 bottom
R602  10R/0.5W  [R1206]  11.5,19.5 270 bottom
SJ401  CAN H term.  [SJ]  7.75,15.75 90 top
SJ402  CAN L term.  [SJ]  5.25,15.75 90 top
SWD1  27.88,15.21 90 top
TP101  20,25.25 0 bottom
TP102  22.75,25.3 0 bottom
TP105  9.5,15 0 bottom
TP106  3.5,15 180 bottom

### Tracks (layer width: path | path; a pad name or v marks a point on that pad's centre or on a via)
3V3  (via drill 0.35)
  Top 0.25: SWD1.1_TVCC v28.52,16.48
  Bottom 0.25: IC302.5_VDDA 14.25,8.5 13.75,9 v13.5,9 C304.2 | IC401.P$3 6.18,11.93 6.5,12.25 8.1,12.25 C405.1 v8.75,11 | IC302.17_VDD 21.25,8.5 v21.75,9 C301.2 | IC302.18_VDDIO2 21.25,8 v21.75,7.5 C305.2 | C207.2 v20.5,29
  other vias: 20.5,29.75 19,29.75 19,29 19.75,29.75 19.75,29
  pour Bottom (no thermals): 21,28.25 18.62,28.25 18.62,30.12 21,30.12
  pour Route15 (isolate 0.406): 33.5,17.75 arc90 17.75,33.5 arc90 2,17.75 arc90 17.75,2 arc90
  cutout Route15: 14.5,19.75 17,19.75 17,15.75 14.5,15.75
  cutout Route15: 18.75,19.75 21,19.75 21,16 18.75,16
  cutout Route15: 19,16 22.5,16 22.5,13.75 19,13.75
  cutout Route15: 14.25,27.75 16.75,27.75 16.75,24.75 14.25,24.75
!STBY!
  Bottom 0.25: IC302.11_PA5 17.71,10.02 17.71,10.73 17.44,11.01 13.49,11.01 10.88,13.62 7.47,13.62 IC401.P$8
BAT+  (via drill 0.35)
  Top 0.5: D601.2 21.32,3.25 v21.25,3.25 | v8.12,27 8.1,27 D607.2 | D604.2 v14.75,4.75
  Route2 0.5: v15.12,27 v8.12,27 | v21.25,3.25 16.25,3.25 v14.75,4.75 14.75,9 v17.75,12 20.76,12 22.72,13.95 22.72,18.63 v22.35,19
  Bottom 0.5: IC202.IN 18.95,25.75 17.05,25.75 IC202.EN | C506.1 v17.75,12 17.81,12.06 IC506.IN | IC601.IN 10.33,27.23 9.5,26.4 C601.2 8.72,26.4 v8.12,27 | v22.35,19 22.35,22.5 D501.C
  other vias: 15.12,26.25 15.12,25.5 15.88,25.5 15.88,26.25 15.88,27
  pour Bottom (no thermals): 20.75,23.88 21.12,23.88 21.75,23.25 21.75,21.75 21.12,21.12 20.75,21.12
  pour Bottom (no thermals): 16.12,26 20.25,26 20.88,25.38 20.88,23.25 19.25,23.25 19.25,25 16.12,25
  pour Bottom (rank 2, no thermals): 17.38,25 14.62,25 14.62,27.75 17.38,27.75
  pour Route2 (no thermals): 16.5,27.5 16.5,25 14.62,25 14.62,27.5
BRAKE_LED_DRIVER:DIE
  pour Top (isolate 0.406, rank 5, no thermals): 35.5,17.75 arc90 17.75,35.5 arc90 0,17.75 arc90 17.75,0 arc90
BRAKE_LED_DRIVER:DIM_BRAKE_DRAIN
  pour Bottom (isolate 0.406, no thermals): 25.25,12 23.38,12 23.38,19 25.25,19
  pour Bottom (isolate 0.406, no thermals): 23.38,18.88 23.38,20 25.25,21.88 25.25,23.25 26.62,23.25 26.62,21.38 25.62,20.38 25.62,18.88
  pour Bottom (isolate 0.406, no thermals): 25.25,35.27 37.5,35.25 38,35.25 38,-3.75 25.25,-3.75
BRAKE_LED_DRIVER:DIM_BRAKE_GATE
  Bottom 0.25: IC507.3G 22.2,12.28 21.48,13 IC506.DRV
BRAKE_LED_DRIVER:LED_AN  (via drill 0.35)
  other vias: 16.25,19 16.25,16.5 16.25,17.75 15.25,19 15.25,17.75 15.25,16.5 15.75,18.25 15.75,17.25
  pour Top (no thermals): 16.62,19.38 14.75,19.38 14.75,16.12 16.62,16.12
  pour Bottom (no thermals): 14.75,16.12 14.75,23.88 16.62,23.88 16.62,16.12
  pour Bottom (no thermals): 18.62,13.25 18.62,12.75 16,12.75 14.75,14 14.75,16.25 16.62,16.25 16.62,14.12 17.5,13.25
BRAKE_LED_DRIVER:LED_CA  (via drill 0.35)
  Bottom 0.5: L501.P$1 v20.25,17.75
  other vias: 19.25,19 19.25,17.75 19.25,16.5 20.25,19 20.25,16.5 19.75,17.25 19.75,18.25
  pour Top (no thermals): 18.88,19.38 20.75,19.38 20.75,16.12 18.88,16.12
CAN_H  (via drill 0.35)
  Top 0.25: v7.25,14.99 SJ401.1 TP105.TP$1
  Bottom 0.25: IC401.P$7 6.82,14.31 7.25,14.74 v7.25,14.99
CAN_INFRA:H  (via drill 0.35)
  Top 0.25: SJ401.2 v7.25,16.51
  Bottom 0.25: R402.2 7.25,18.05 v7.25,16.51
CAN_INFRA:L  (via drill 0.35)
  Top 0.25: SJ402.2 v5.75,16.51
  Bottom 0.25: R401.1 5.75,18.05 v5.75,16.51
CAN_INFRA:SPLIT
  pour Bottom (no thermals): 4.5,19.88 8.5,19.88 8.5,21.12 6.25,21.12 6.25,22.75 5.5,22.75 5.5,22.12 4.5,21.12
CAN_L  (via drill 0.35)
  Top 0.25: v5.75,14.99 SJ402.1 5.24,15 TP106.TP$1
  Bottom 0.25: IC401.P$6 6.18,14.31 5.75,14.74 v5.75,14.99
CAN_RX  (via drill 0.35)
  Route15 0.25: v18.5,7.5 18.5,7.84 14.25,12.09 6.51,12.09 5.1,10.68 v5.1,9.77
  Bottom 0.25: IC401.P$4 5.53,10.2 v5.1,9.77 | IC302.19_PA9-[PA11] v18.5,7.5
CAN_TX  (via drill 0.35)
  Route15 0.25: v8.25,9.75 8.25,8.66 10.05,6.86 v17.75,6.86
  Bottom 0.25: IC302.20_PA10-[PA12] 18.89,7 18.75,6.86 v17.75,6.86 | IC401.P$1 8.25,10.2 v8.25,9.75
CUT
  cutout Top: 26,20.25 26,15.25 arc90 27,14.25 28.75,14.25 arc90 29.75,15.25 29.75,20.25 arc90 28.75,21.25 27,21.25 arc90
  cutout Bottom: 29.75,20.25 29.75,15.25 arc-90 28.75,14.25 27,14.25 arc-90 26,15.25 26,20.25 arc-90 27,21.25 28.75,21.25 arc-90
DIM_BRAKE  (via drill 0.35)
  Route15 0.25: v18.75,11 18.84,11.09 18.84,12.91 v17.75,14
  Bottom 0.25: IC302.12_PA6 18.25,10.73 18.52,11 v18.75,11 | IC506.DIM 17.81,13.94 v17.75,14
DIM_REAR  (via drill 0.35)
  Route15 0.25: v18.75,4.5 19.59,5.34 19.59,13.28 18.16,14.71 18.16,19.5 12.84,24.82 12.84,26.91 v11.25,28.5
  Bottom 0.25: IC601.DIM R601.2 v11.25,28.5 | v18.75,4.5 IC302.23_PA15
GND  (via drill 0.35)
  Top 0.25: SWD1.5_GND v28.52,19.02
  other vias: 18,28 20.5,26.75 15.5,29.25 11,9 24.25,7.5 18.75,9 15.25,12 21.75,15.25 21,15.25 20.25,15.25 21,14.5 21.75,14.5 20.25,14.5 19.5,14.5 19.5,15.25 7.75,22.25 8.75,13 11,7.5 9,24.75 11.5,25.75 11.5,18 12.75,28.5 24.25,9 12.25,18 10.75,18
  pour Bottom (rank 3): 35.5,17.75 arc90 17.75,35.5 arc90 0,17.75 arc90 17.75,0 arc90
  pour Bottom (no thermals): 23,13.75 19,13.75 19,15.75 23,15.75
  pour Route2 (isolate 0.406, rank 6): 35.5,17.75 arc90 17.75,35.5 arc90 0,17.75 arc90 17.75,0 arc90
  pour Bottom (no thermals): 22,14.5 22,12.75 23,12.75 23,14.5
  cutout Route2 (rank 2): 18.5,19.75 21,19.75 21,15.75 18.5,15.75
  cutout Route2: 14.5,19.75 17,19.75 17,15.75 14.5,15.75
  cutout Route2: 18.25,30.5 21.25,30.5 21.25,28.25 18.25,28.25
REAR_LED_DRIVER:CS
  Bottom 0.5: IC601.CS R602.1
REAR_LED_DRIVER:D1,D2  (via drill 0.35)
  Top 0.5: v23.5,5.25 23.87,5.62 D601.4 | v23.5,5.25 | D602.2 v29.75,9
  Route2 0.5: v23.5,5.25 v29.75,9
REAR_LED_DRIVER:D2,D3  (via drill 0.35)
  Top 0.5: D603.2 32.62,18.8 v32.62,18.75 | D602.4 v29.99,12.49 v30,12.5
  Route2 0.5: v32.62,18.75 v30,12.5
REAR_LED_DRIVER:D4,D5  (via drill 0.35)
  Top 0.5: D605.2 v7,9.75 | D604.4 v11.25,4.37 v11.25,4.38
  Route2 0.5: v7,9.75 v11.25,4.38
REAR_LED_DRIVER:D5,D6  (via drill 0.35)
  Top 0.5: v3.25,20.75 4.4,19.6 D606.2 | D605.4 4.25,11.57 v4.25,11.5
  Route2 0.5: v4.25,11.5 4.5,11.75 4.5,19.5 v3.25,20.75
REAR_LED_DRIVER:D7,D8  (via drill 0.35)
  Top 0.5: D607.4 9.39,30.02 v9.38,30
  Route2 0.5: v9.38,30 D608.2
  other vias: 16.25,31
REAR_LED_DRIVER:D8,D9  (via drill 0.35)
  Top 0.5: D609.2 25.11,28.89 v25,29
  Route2 0.5: D608.4 v25,29
  other vias: 19.25,32.5
REAR_LED_DRIVER:SINK  (via drill 0.35)
  Top 0.5: D609.4 v28.5,28 | D603.4 30.5,21.62 v30.5,21.75 | D606.4 3.45,21.82 v3.5,21.88
  Route2 0.5: v28.5,28 v30.5,21.75 30.02,23.26 30.01,23.25 4.88,23.25 v3.5,21.88
  Bottom 0.5: v3.5,21.88 5.12,23.5 10.03,23.5 10.55,24.02 IC601.SINK
SYS_NRST  (via drill 0.35)
  Top 0.25: SWD1.3_T_NRST v28.52,17.75
  Route2 0.25: v17,8.25 18.5,9.75 20.5,9.75 26,15.25 26,16.25 26.88,17.12 27.89,17.12 v28.52,17.75
  Bottom 0.25: v17,8.25 16.75,8 IC302.4_NRST 14.25,8 13.75,7.5 C307.2
SYS_SWCLK  (via drill 0.35)
  Top 0.25: SWD1.4_T_SWCLK v27.23,17.75
  Route2 0.25: v27.23,17.75 27.26,17.75 27.84,18.34 29.01,18.34 29.36,18 29.36,15.25 23,8.89 23,7.75 21,5.75 20.32,5.75 v20.18,5.88
  Bottom 0.25: IC302.22_PA14 19.29,5.88 v20.18,5.88
SYS_SWDIO  (via drill 0.35)
  Top 0.25: SWD1.2_T_SWDIO v27.25,16.48
  Route2 0.25: v20.75,6.59 20.75,9 26.75,15 26.75,15.98 v27.25,16.48
  Bottom 0.25: v20.75,6.59 20.66,6.5 IC302.21_PA13

### Text on the board
Top: Die | Die | Die | Die
Route2: GND | GND | GND | GND
Route15: 3V3 | 3V3 | 3V3 | 3V3
Bottom: GND | GND | GND | GND
bPlace: BAT+ | GND | L | H | CAN term.
tStop: Mj818 clone / SuperNova Mini2 / ejovrh rev. 5a
Document: SuperNova Mini2 housing